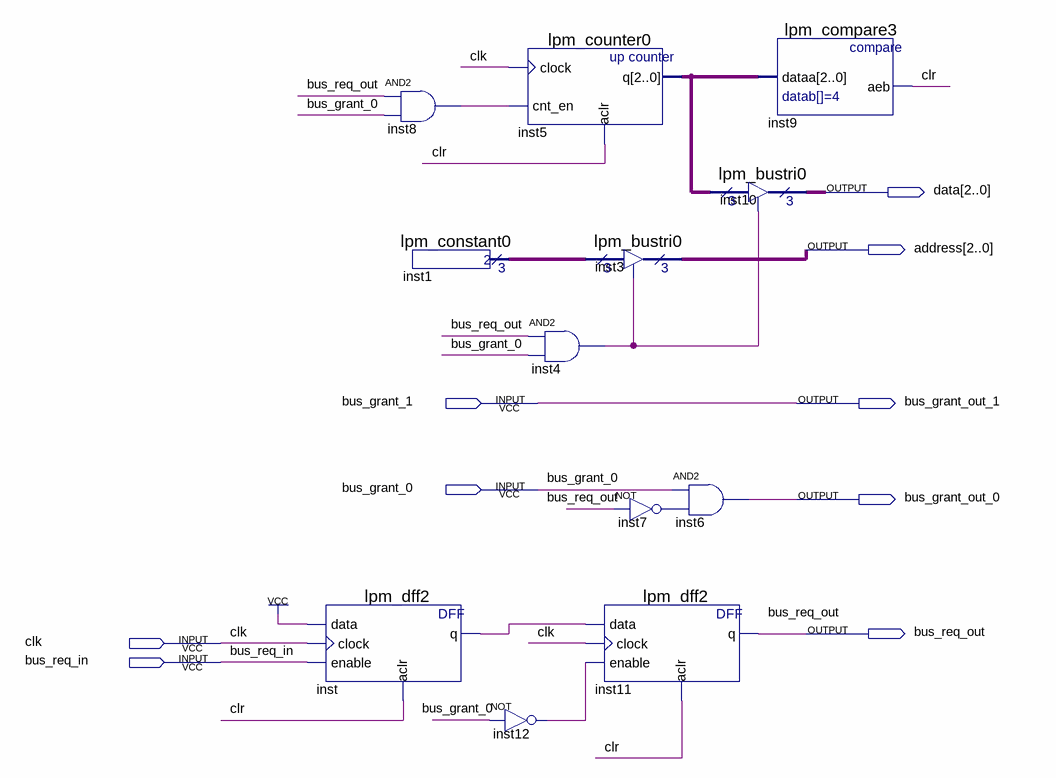
[diagram p0: schematic sheet]
// Quartus schematic Master_0_0.bdf as structural Verilog: 12 symbols, 9 pins
module Master_0_0 (
  input  bus_grant_1,
  input  bus_grant_0,
  input  clk,
  input  bus_req_in,
  output [2:0] data,
  output [2:0] address,
  output bus_grant_out_1,
  output bus_grant_out_0,
  output bus_req_out
);

  wire clr, inst4_out, inst7_out, inst8_out, inst12_out, inst_q;
  wire [2:0] inst1_result, inst5_q;

  lpm_dff2 inst (.data(1'b1), .clock(clk), .enable(bus_req_in), .aclr(clr), .q(inst_q));
  and inst8 (inst8_out, bus_req_out, bus_grant_0);
  lpm_constant0 inst1 (.result(inst1_result));
  not inst12 (inst12_out, bus_grant_0);
  lpm_counter0 inst5 (.clock(clk), .cnt_en(inst8_out), .aclr(clr), .q(inst5_q));
  and inst4 (inst4_out, bus_req_out, bus_grant_0);
  lpm_bustri0 inst3 (.enabledt(inst4_out), .data(inst1_result), .tridata(address));
  not inst7 (inst7_out, bus_req_out);
  lpm_dff2 inst11 (.data(inst_q), .clock(clk), .enable(inst12_out), .aclr(clr), .q(bus_req_out));
  lpm_bustri0 inst10 (.enabledt(inst4_out), .data(inst5_q), .tridata(data));
  and inst6 (bus_grant_out_0, bus_grant_0, inst7_out);
  lpm_compare3 inst9 (.dataa(inst5_q), .aeb(clr));

  assign bus_grant_out_1 = bus_grant_1;
endmodule
